# Altium schematic sheet PERIPHERAL.SchDoc
size A4; SheetNumber: 5; SheetTotal: 6
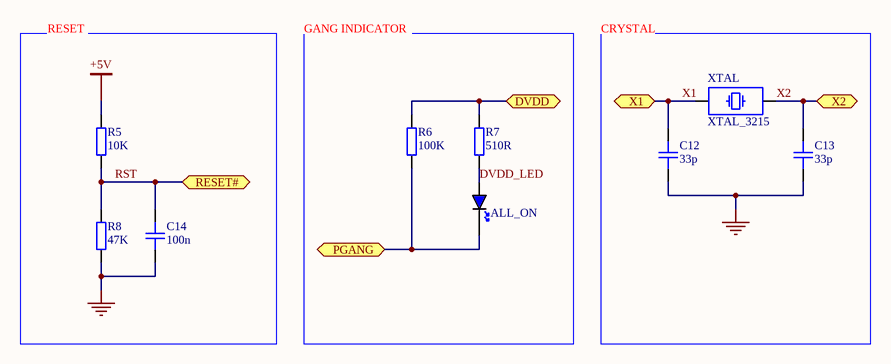
[diagram p0: PERIPHERAL.SchDoc]

## Parts
ALL_ON  BLUE  [LED_0603_BLUE]  (value not drawn)
C12  33p  [CAP_0402]
C13  33p  [CAP_0402]
C14  100n  [CAP_0805]
R5  10K  [RES_0805]
R6  100K  [RES_0603]
R7  510R  [RES_0603]
R8  47K  [RES_0603]
XTAL  XTAL_3215  [XTAL_3215-2]

## Ports
DVDD (bidir), PGANG (bidir), RESET# (bidir), X1 (bidir), X2 (bidir)

## Nets
+5V: R5.2
GND: C12.1 C13.1 C14.1 R8.1
DVDD: R6.2 R7.2 ; port DVDD
DVDD_LED: ALL_ON.A R7.1
PGANG: ALL_ON.K R6.1 ; port PGANG
RST: C14.2 R5.1 R8.2 ; port RESET#
X1: C12.2 XTAL.1 ; port X1
X2: C13.2 XTAL.2 ; port X2

## Notes on the sheet
- RESET
- GANG INDICATOR
- CRYSTAL

## Library data of the parts
ALL_ON = LED_0603_BLUE: LED 0603 BLUE SMD
C12 C13 = CAP_0402: Capacitor SMD 0402; Manufacturer: *; Manufacturer Part Number: *; Distributor Link: *; LCSC: *; Rating: *; Dielectric: *
C14 = CAP_0805: Capacitor SMD 0805; Manufacturer: *; Manufacturer Part Number: *; Distributor Link: *; LCSC: *; Rating: *; Dielectric: *
R5 = RES_0805: Resistor SMD 0805; Manufacturer: *; Manufacturer Part Number: *; Distributor Link: *; LCSC: *
R6-R8 = RES_0603: Resistor SMD 0603; Manufacturer: *; Manufacturer Part Number: *; Distributor Link: *; LCSC: *
XTAL = XTAL_3215: Crystal SMD 3215; Distributor Link: *